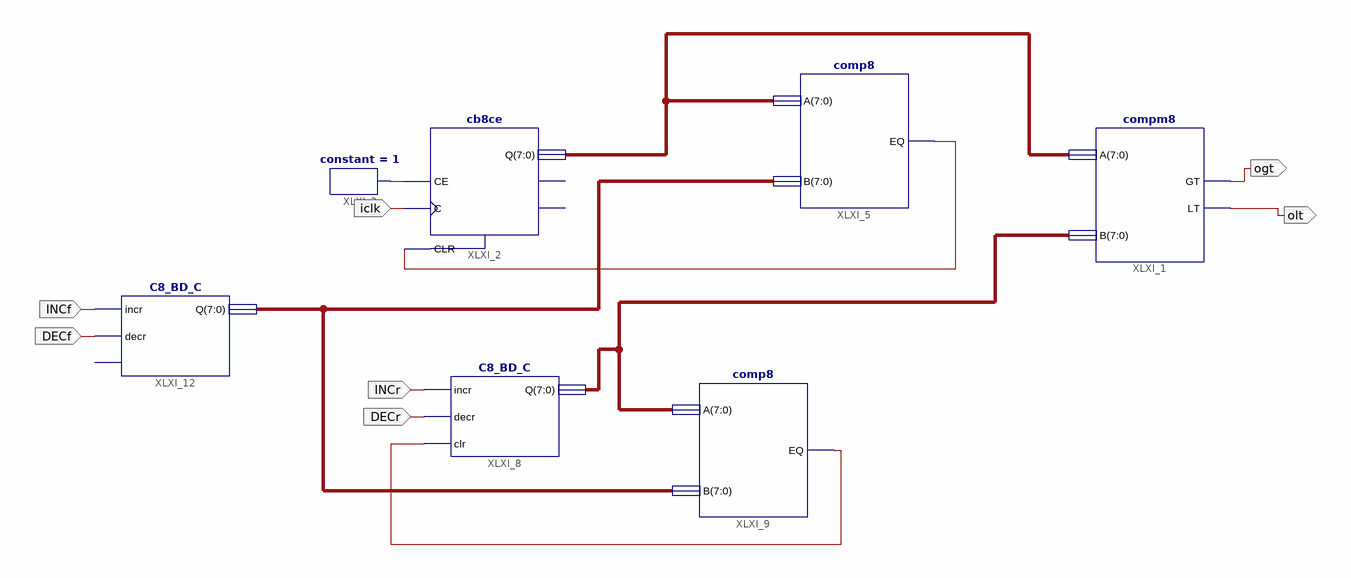
[diagram p0: schematic sheet 1]
// Xilinx ISE schematic Scheme.sch (spartan6) as structural Verilog: 7 symbols, 7 ports
module Scheme (
  input  iclk,
  input  INCr,
  input  DECr,
  input  INCf,
  input  DECf,
  output ogt,
  output olt
);

  wire XLXN_7, XLXN_19, XLXN_26;
  wire [7:0] XLXN_18, XLXN_21, XLXN_30;

  cb8ce XLXI_2 (.C(iclk), .CE(XLXN_7), .CLR(XLXN_19), .Q(XLXN_18));  // open: CEO, TC
  constant #(.CValue("1")) XLXI_3 (.O(XLXN_7));
  comp8 XLXI_5 (.A(XLXN_18), .B(XLXN_30), .EQ(XLXN_19));
  compm8 XLXI_1 (.A(XLXN_18), .B(XLXN_21), .GT(ogt), .LT(olt));
  C8_BD_C XLXI_8 (.incr(INCr), .decr(DECr), .clr(XLXN_26), .Q(XLXN_21));
  comp8 XLXI_9 (.A(XLXN_21), .B(XLXN_30), .EQ(XLXN_26));
  C8_BD_C XLXI_12 (.incr(INCf), .decr(DECf), .Q(XLXN_30));  // open: clr
endmodule
